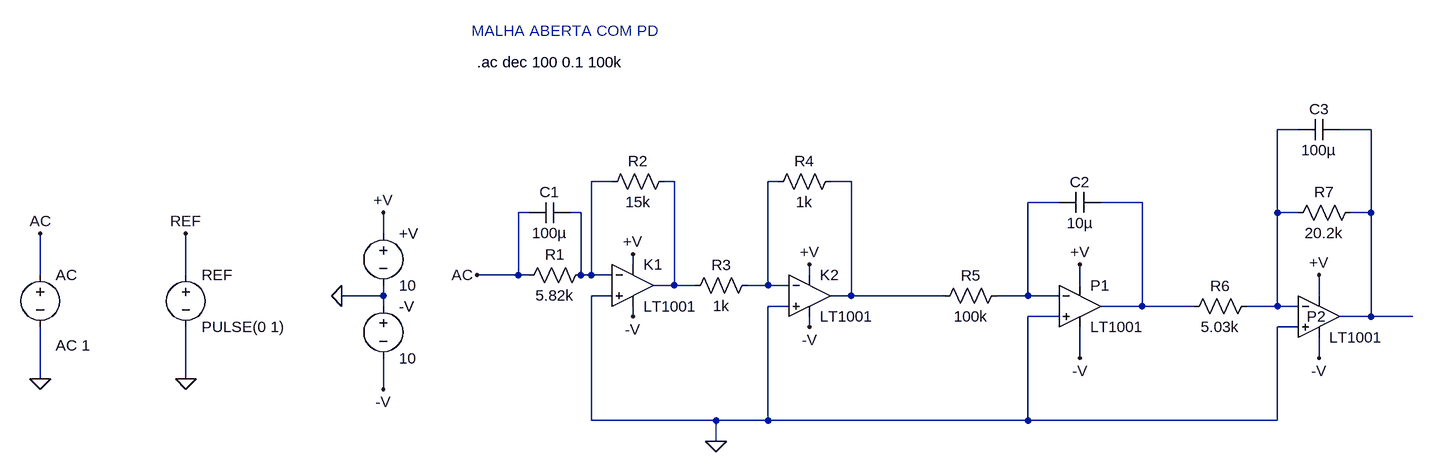
[diagram p0: schematic OL_PD.asc]
OL_PD.asc, the LTspice schematic file:
Version 4
SHEET 1 1864 680
WIRE 992 16 960 16
WIRE 1104 16 1056 16
WIRE -64 96 -96 96
WIRE 32 96 16 96
WIRE 192 96 176 96
WIRE 304 96 272 96
WIRE 624 128 576 128
WIRE 752 128 688 128
WIRE -192 144 -208 144
WIRE -112 144 -128 144
WIRE 960 144 960 16
WIRE 992 144 960 144
WIRE 1104 144 1104 16
WIRE 1104 144 1072 144
WIRE -416 176 -416 144
WIRE -32 224 -32 208
WIRE -944 240 -944 176
WIRE -720 240 -720 176
WIRE -208 240 -208 144
WIRE -208 240 -272 240
WIRE -192 240 -208 240
WIRE -112 240 -112 144
WIRE -96 240 -96 96
WIRE -96 240 -112 240
WIRE -64 240 -96 240
WIRE 240 240 240 224
WIRE 32 256 32 96
WIRE 32 256 0 256
WIRE 64 256 32 256
WIRE 176 256 176 96
WIRE 176 256 144 256
WIRE 208 256 176 256
WIRE 656 256 656 224
WIRE -416 272 -416 256
WIRE -416 272 -480 272
WIRE -64 272 -96 272
WIRE 304 272 304 96
WIRE 304 272 272 272
WIRE 448 272 304 272
WIRE 576 272 576 128
WIRE 576 272 528 272
WIRE 624 272 576 272
WIRE 1024 272 1024 240
WIRE -416 288 -416 272
WIRE 208 288 176 288
WIRE 752 288 752 128
WIRE 752 288 688 288
WIRE 832 288 752 288
WIRE 960 288 960 144
WIRE 960 288 912 288
WIRE 992 288 960 288
WIRE -32 304 -32 288
WIRE 624 304 576 304
WIRE 1104 304 1104 144
WIRE 1104 304 1056 304
WIRE 1168 304 1104 304
WIRE 240 320 240 304
WIRE 992 320 960 320
WIRE 656 368 656 320
WIRE 1024 368 1024 336
WIRE -944 400 -944 320
WIRE -720 400 -720 320
WIRE -416 416 -416 368
WIRE -96 464 -96 272
WIRE 96 464 -96 464
WIRE 176 464 176 288
WIRE 176 464 96 464
WIRE 576 464 576 304
WIRE 576 464 176 464
WIRE 960 464 960 320
WIRE 960 464 576 464
WIRE 96 496 96 464
FLAG 656 224 +V
FLAG 1024 240 +V
FLAG 656 368 -V
FLAG 1024 368 -V
FLAG -416 144 +V
FLAG -416 416 -V
FLAG -480 272 0
FLAG -720 400 0
FLAG -720 176 REF
FLAG 96 496 0
FLAG -32 208 +V
FLAG 240 224 +V
FLAG -32 304 -V
FLAG 240 320 -V
FLAG -272 240 AC
FLAG -944 400 0
FLAG -944 176 AC
SYMBOL Opamps\\LT1001 656 224 R0
SYMATTR InstName P1
SYMBOL Opamps\\LT1001 1024 240 R0
WINDOW 0 -19 64 Left 2
SYMATTR InstName P2
SYMBOL res 544 256 R90
WINDOW 0 0 56 VBottom 2
WINDOW 3 32 56 VTop 2
SYMATTR InstName R5
SYMATTR Value 100k
SYMBOL res 928 272 R90
WINDOW 0 0 56 VBottom 2
WINDOW 3 32 56 VTop 2
SYMATTR InstName R6
SYMATTR Value 5.03k
SYMBOL res 1088 128 R90
WINDOW 0 0 56 VBottom 2
WINDOW 3 32 56 VTop 2
SYMATTR InstName R7
SYMATTR Value 20.2k
SYMBOL cap 1056 0 R90
WINDOW 0 0 32 VBottom 2
WINDOW 3 32 32 VTop 2
SYMATTR InstName C3
SYMATTR Value 100µ
SYMBOL cap 688 112 R90
WINDOW 0 0 32 VBottom 2
WINDOW 3 32 32 VTop 2
SYMATTR InstName C2
SYMATTR Value 10µ
SYMBOL voltage -416 160 R0
WINDOW 123 0 0 Left 2
WINDOW 39 0 0 Left 2
SYMATTR InstName +V
SYMATTR Value 10
SYMBOL voltage -416 272 R0
WINDOW 123 0 0 Left 2
WINDOW 39 0 0 Left 2
SYMATTR InstName -V
SYMATTR Value 10
SYMBOL voltage -720 224 R0
WINDOW 123 0 0 Left 2
WINDOW 39 0 0 Left 2
SYMATTR InstName REF
SYMATTR Value PULSE(0 1)
SYMBOL Opamps\\LT1001 -32 192 R0
SYMATTR InstName K1
SYMBOL Opamps\\LT1001 240 208 R0
SYMATTR InstName K2
SYMBOL res -96 224 R90
WINDOW 0 0 56 VBottom 2
WINDOW 3 32 56 VTop 2
SYMATTR InstName R1
SYMATTR Value 5.82k
SYMBOL cap -128 128 R90
WINDOW 0 0 32 VBottom 2
WINDOW 3 32 32 VTop 2
SYMATTR InstName C1
SYMATTR Value 100µ
SYMBOL res 160 240 R90
WINDOW 0 0 56 VBottom 2
WINDOW 3 32 56 VTop 2
SYMATTR InstName R3
SYMATTR Value 1k
SYMBOL res 32 80 R90
WINDOW 0 0 56 VBottom 2
WINDOW 3 32 56 VTop 2
SYMATTR InstName R2
SYMATTR Value 15k
SYMBOL res 288 80 R90
WINDOW 0 0 56 VBottom 2
WINDOW 3 32 56 VTop 2
SYMATTR InstName R4
SYMATTR Value 1k
SYMBOL voltage -944 224 R0
WINDOW 123 24 124 Left 2
WINDOW 39 0 0 Left 2
SYMATTR Value2 AC 1
SYMATTR InstName AC
SYMATTR Value ""
TEXT -280 -136 Left 2 ;MALHA ABERTA COM PD
TEXT -272 -88 Left 2 !.ac dec 100 0.1 100k

The netlist it stands for:
* OL_PD.asc
XP1 0 N007 +V -V N008 LT1001  ; pins In+ In- V+ V- OUT
XP2 0 N001 +V -V N002 LT1001  ; pins In+ In- V+ V- OUT
R5 N007 N006 100k
R6 N001 N008 5.03k
R7 N002 N001 20.2k
C3 N002 N001 100µ
C2 N008 N007 10µ
V§+V +V 0 10
V§-V 0 -V 10
V§REF REF 0 PULSE(0 1)
XK1 0 N003 +V -V N004 LT1001  ; pins In+ In- V+ V- OUT
XK2 0 N005 +V -V N006 LT1001  ; pins In+ In- V+ V- OUT
R1 N003 AC 5.82k
C1 N003 AC 100µ
R3 N005 N004 1k
R2 N004 N003 15k
R4 N006 N005 1k
V§AC AC 0 AC 1
* MALHA ABERTA COM PD
.ac dec 100 0.1 100k
.lib LTC.lib
.backanno
.end